# EAGLE schematic board (EAGLE 7.2.0)
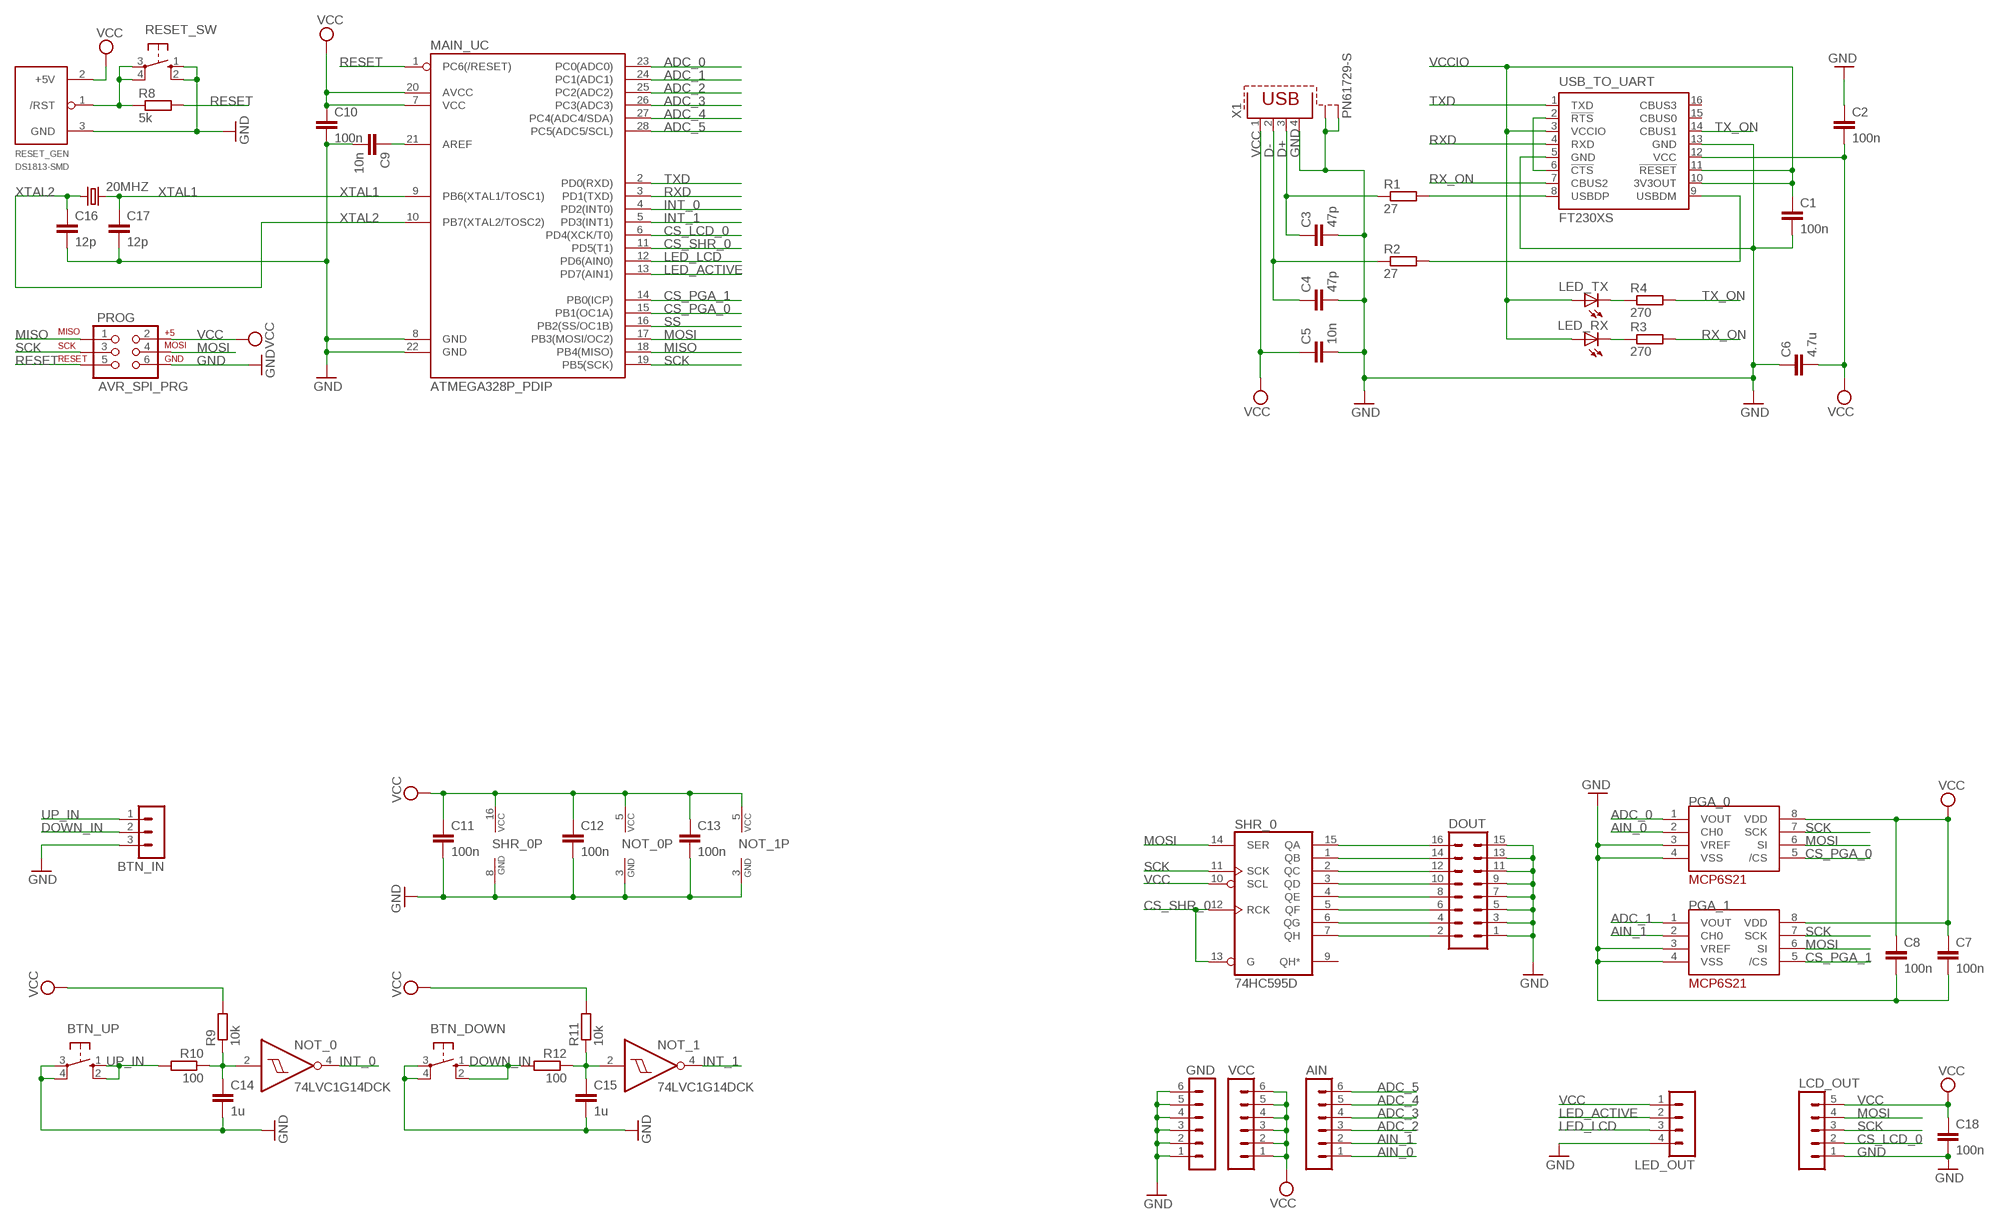
[diagram p0: schematic, sheet 1]

## Parts
20MHZ  CRYSTALHC49S  [HC49/S]
AIN  MA06-1  [MA06-1]
BTN_DOWN  10-XX  [B3F-10XX]
BTN_IN  MA03-1  [MA03-1]
BTN_UP  10-XX  [B3F-10XX]
C1  100n  C-EUC1206  [C1206]
C2  100n  C-EUC1206  [C1206]
C3  47p  C-EUC1206  [C1206]
C4  47p  C-EUC1206  [C1206]
C5  10n  C-EUC1206  [C1206]
C6  4.7u  C-EU025-025X050  [C025-025X050]
C7  100n  C-EUC1206  [C1206]
C8  100n  C-EUC1206  [C1206]
C9  10n  C-EUC1206  [C1206]
C10  100n  C-EUC1206  [C1206]
C11  100n  C-EUC1206  [C1206]
C12  100n  C-EUC1206  [C1206]
C13  100n  C-EUC1206  [C1206]
C14  1u  C-EU025-024X044  [C025-024X044]
C15  1u  C-EU025-024X044  [C025-024X044]
C16  12p  C-EUC1206  [C1206]
C17  12p  C-EUC1206  [C1206]
C18  100n  C-EUC1206  [C1206]
DOUT  MA08-2  [MA08-2]
GND  MA06-1  [MA06-1]
LCD_OUT  MA05-1  [MA05-1]
LED_OUT  MA04-1  [MA04-1]
LED_RX  LEDLD260  [LD260]
LED_TX  LEDLD260  [LD260]
MAIN_UC  ATMEGA328P_PDIP  [DIL28-3]
NOT_0  74LVC1G14DCK  [SC70-5]
NOT_1  74LVC1G14DCK  [SC70-5]
PGA_0  MCP6S21I/SN  [SO-08]
PGA_1  MCP6S21I/SN  [SO-08]
PROG  AVR_SPI_PRG  AVR_SPI_PRG_6PTH  [2X3]
R1  27  R-EU_R1206  [R1206]
R2  27  R-EU_R1206  [R1206]
R3  270  R-EU_R1206  [R1206]
R4  270  R-EU_R1206  [R1206]
R8  5k  R-EU_R1206  [R1206]
R9  10k  R-EU_R1206  [R1206]
R10  100  R-EU_R1206  [R1206]
R11  10k  R-EU_R1206  [R1206]
R12  100  R-EU_R1206  [R1206]
RESET_GEN  DS1813-SMD  [SOT-23]
RESET_SW  10-XX  [B3F-10XX]
SHR_0  74HC595D  [SO16]
USB_TO_UART  FT230XS  [SSOP16]
VCC  MA06-1  [MA06-1]
X1  PN61729-S  [PN61729-S]

## Nets
ADC_0: MAIN_UC.23(PC0(ADC0)) PGA_0.1(VOUT)
ADC_1: MAIN_UC.24(PC1(ADC1)) PGA_1.1(VOUT)
ADC_2: AIN.3 MAIN_UC.25(PC2(ADC2))
ADC_3: AIN.4 MAIN_UC.26(PC3(ADC3))
ADC_4: AIN.5 MAIN_UC.27(PC4(ADC4/SDA))
ADC_5: AIN.6 MAIN_UC.28(PC5(ADC5/SCL))
AIN_0: AIN.1 PGA_0.2(CH0)
AIN_1: AIN.2 PGA_1.2(CH0)
CS_LCD_0: LCD_OUT.2 MAIN_UC.6(PD4(XCK/T0))
CS_PGA_0: MAIN_UC.15(PB1(OC1A)) PGA_0.5(/CS)
CS_PGA_1: MAIN_UC.14(PB0(ICP)) PGA_1.5(/CS)
CS_SHR_0: MAIN_UC.11(PD5(T1)) SHR_0.12(RCK) SHR_0.13(G)
D+: C3.1 R1.1 X1.3
D-: C4.1 R2.1 X1.2
DOWN_IN: BTN_DOWN.1(S) BTN_DOWN.2(S1) BTN_IN.2 R12.2
GND: BTN_DOWN.3(P) BTN_DOWN.4(P1) BTN_IN.3 BTN_UP.3(P) BTN_UP.4(P1) C1.2 C2.1 C3.2 C4.2 C5.2 C6.1 C7.2 C8.2 C9.2 C10.2 C11.2 C12.2 C13.2 C14.2 C15.2 C16.2 C17.2 C18.2 DOUT.1 DOUT.3 DOUT.5 DOUT.7 DOUT.9 DOUT.11 DOUT.13 DOUT.15 GND.1 GND.2 GND.3 GND.4 GND.5 GND.6 LCD_OUT.1 LED_OUT.4 MAIN_UC.8(GND) MAIN_UC.22(GND) NOT_0.3(GND) NOT_1.3(GND) PGA_0.3(VREF) PGA_0.4(VSS) PGA_1.3(VREF) PGA_1.4(VSS) PROG.6 RESET_GEN.3(GND) RESET_SW.1(S) RESET_SW.2(S1) SHR_0.8(GND) USB_TO_UART.5(GND) USB_TO_UART.13(GND) X1.4 X1.S1 X1.S2
INT_0: MAIN_UC.4(PD2(INT0)) NOT_0.4(O)
INT_1: MAIN_UC.5(PD3(INT1)) NOT_1.4(O)
LED_ACTIVE: LED_OUT.2 MAIN_UC.13(PD7(AIN1))
LED_LCD: LED_OUT.3 MAIN_UC.12(PD6(AIN0))
MISO: MAIN_UC.18(PB4(MISO)) PROG.1
MOSI: LCD_OUT.4 MAIN_UC.17(PB3(MOSI/OC2)) PGA_0.6(SI) PGA_1.6(SI) PROG.4 SHR_0.14(SER)
N$1: LED_TX.K(C) R4.1
N$2: R2.2 USB_TO_UART.9(USBDM)
N$3: LED_RX.K(C) R3.1
N$4: DOUT.16 SHR_0.15(QA)
N$5: USB_TO_UART.2(!RTS) USB_TO_UART.6(!CTS)
N$6: R1.2 USB_TO_UART.8(USBDP)
N$7: DOUT.14 SHR_0.1(QB)
N$8: DOUT.12 SHR_0.2(QC)
N$9: DOUT.10 SHR_0.3(QD)
N$10: DOUT.8 SHR_0.4(QE)
N$11: DOUT.6 SHR_0.5(QF)
N$12: DOUT.4 SHR_0.6(QG)
N$13: DOUT.2 SHR_0.7(QH)
N$14: C9.1 MAIN_UC.21(AREF)
N$17: R8.1 RESET_GEN.1(/RST) RESET_SW.3(P) RESET_SW.4(P1)
N$20: C14.1 NOT_0.2(I) R9.1 R10.1
N$21: C15.1 NOT_1.2(I) R11.1 R12.1
RESET: MAIN_UC.1(PC6(/RESET)) PROG.5 R8.2
RX_ON: R3.2 USB_TO_UART.7(CBUS2)
RXD: MAIN_UC.3(PD1(TXD)) USB_TO_UART.4(RXD)
SCK: LCD_OUT.3 MAIN_UC.19(PB5(SCK)) PGA_0.7(SCK) PGA_1.7(SCK) PROG.3 SHR_0.11(SCK)
SS: MAIN_UC.16(PB2(SS/OC1B))
TX_ON: R4.2 USB_TO_UART.14(CBUS1)
TXD: MAIN_UC.2(PD0(RXD)) USB_TO_UART.1(TXD)
UP_IN: BTN_IN.1 BTN_UP.1(S) BTN_UP.2(S1) R10.2
VCC: C2.2 C5.1 C6.2 C7.1 C8.1 C10.1 C11.1 C12.1 C13.1 C18.1 LCD_OUT.5 LED_OUT.1 MAIN_UC.7(VCC) MAIN_UC.20(AVCC) NOT_0.5(VCC) NOT_1.5(VCC) PGA_0.8(VDD) PGA_1.8(VDD) PROG.2 R9.2 R11.2 RESET_GEN.2(+5V) SHR_0.10(SCL) SHR_0.16(VCC) USB_TO_UART.12(VCC) VCC.1 VCC.2 VCC.3 VCC.4 VCC.5 VCC.6 X1.1
VCCIO: C1.1 LED_RX.A LED_TX.A USB_TO_UART.3(VCCIO) USB_TO_UART.10(3V3OUT) USB_TO_UART.11(!RESET)
XTAL1: 20MHZ.2 C17.1 MAIN_UC.9(PB6(XTAL1/TOSC1))
XTAL2: 20MHZ.1 C16.1 MAIN_UC.10(PB7(XTAL2/TOSC2))
Unconnected: SHR_0.9(QH*) USB_TO_UART.15(CBUS0) USB_TO_UART.16(CBUS3)

## Library data of the parts
20MHZ = crystal:CRYSTAL: CRYSTAL; OC_FARNELL: 1667008; OC_NEWARK: unknown
AIN GND VCC = con-lstb:MA06-1: PIN HEADER; OC_FARNELL: unknown; OC_NEWARK: unknown
BTN_DOWN BTN_UP RESET_SW = switch-omron:10-XX: OMRON SWITCH; MPN: B3F-1000; OC_FARNELL: 176432; OC_NEWARK: 36M3542
BTN_IN = con-lstb:MA03-1: PIN HEADER; OC_FARNELL: unknown; OC_NEWARK: unknown
C1-C18 = resistor:C-EU: CAPACITOR, European symbol
DOUT = con-lstb:MA08-2: PIN HEADER; OC_FARNELL: unknown; OC_NEWARK: unknown
LCD_OUT = con-lstb:MA05-1: PIN HEADER; OC_FARNELL: unknown; OC_NEWARK: unknown
LED_OUT = con-lstb:MA04-1: PIN HEADER; OC_FARNELL: unknown; OC_NEWARK: unknown
LED_RX LED_TX = led:LED: LED OSRAM: - CHIPLED LG R971, LG N971, LY N971, LG Q971, LY Q971, LO R971, LY R971 LH N974, LH R974 LS Q976, LO Q976, LY Q976 LO Q996 - Hyper CHIPLED LW Q18S LB Q993, LB Q99A, LB R99A - SideLED LS A670, LO A670, LY A670, LG A670, LP A670 LB A673, LV A673, LT A673, LW A673 LH A674 LY A675 LS A676, LA A676, LO A676, LY A676, LW A676 LS A679, LY A679, LG A679 - Hyper Micro SIDELED® LS Y876, LA Y876, LO Y876, LY Y876 LT Y87S - SmartLED LW L88C, LW L88S LB L89C, LB L89S, LG L890 LS L89K, LO L89K, LY L89K LS L896, LA L896, LO L896, LY L896 - TOPLED LS T670, LO T670, LY T670, LG T670, LP T670 LSG T670, LSP T670, LSY T670, LOP T670, LYG T670 LG T671, LOG T671, LSG T671 LB T673, LV T673, LT T673, LW T673 LH T674 LS T676, LA T676, LO T676, LY T676, LB T676, LH T676, LSB T676, LW T676 LB T67C, LV T67C, LT T67C, LS T67K, LO T67K, LY T67K, LW E67C LS E67B, LA E67B, LO E67B, LY E67B, LB E67C, LV E67C, LT E67C LW T67C LS T679, LY T679, LG T679 LS T770, LO T770, LY T770, LG T770, LP T770 LB T773, LV T773, LT T773, LW T773 LH T774 LS E675, LA E675, LY E675, LS T675 LS T776, LA T776, LO T776, LY T776, LB T776 LHGB T686 LT T68C, LB T68C - Hyper Mini TOPLED® LB M676 - Mini TOPLED Santana® LG M470 LS M47K, LO M47K, LY M47K Source: http://www.osram.convergy.de LUXEON: - LUMILED® LXK2-PW12-R00, LXK2-PW12-S00, LXK2-PW14-U00, LXK2-PW14-V00 LXK2-PM12-R00, LXK2-PM12-S00, LXK2-PM14-U00 LXK2-PE12-Q00, LXK2-PE12-R00, LXK2-PE12-S00, LXK2-PE14-T00, LXK2-PE14-U00 LXK2-PB12-K00, LXK2-PB12-L00, LXK2-PB12-M00, LXK2-PB14-N00, LXK2-PB14-P00, LXK2-PB14-Q00 LXK2-PR12-L00, LXK2-PR12-M00, LXK2-PR14-Q00, LXK2-PR14-R00 LXK2-PD12-Q00, LXK2-PD12-R00, LXK2-PD12-S00 LXK2-PH12-R00, LXK2-PH12-S00 LXK2-PL12-P00, LXK2-PL12-Q00, LXK2-PL12-R00 Source: www.luxeon.com KINGBRIGHT: KA-3528ASYC Source: www.kingbright.com
MAIN_UC = SparkFun-DigitalIC:ATMEGA328P_PDIP: uC used in the Arduino 32kb flash, 1k EEPROM, 2k SRAM This is the through-hole version of this chip.
NOT_0 NOT_1 = 74xx-little-us:74*1G14: Single Schmitt-Trigger Inverter Gate
PGA_0 PGA_1 = MPC6S21:MCP6S21
PROG = SparkFun:AVR_SPI_PRG_6: AVR ISP 6 Pin This is the reduced ISP connector for AVR programming. Common on Arduino. This footprint will take up less PCB space and can be used with a 10-pin to 6-pin adapter such as SKU: BOB-08508
R1-R4 R8-R12 = rcl:R-EU_: RESISTOR, European symbol
RESET_GEN = ds1813_revised:DS1813
SHR_0 = 74xx-eu:74*595: 8-bit SHIFT REGISTER, output latch
USB_TO_UART = ftdichip:FT230X: USB to BASIC UART IC Auto generated by make-symbol-device-package-bsdl.ulp Rev. 43 Source: Data sheet <http://www.ftdichip.com/Support/Documents/DataSheets/ICs/DS_FT230X.pdf>
X1 = con-berg:PN61729-S: BERG USB connector; OC_FARNELL: unknown; OC_NEWARK: unknown

## Net classes
0 default: clearance 0.205 mm